# Altium schematic sheet Transistor Circuit.SchDoc
size A; DrawnBy: Jonathan Reese; Engineer: Jonathan Reese; Organization: URC; DocumentNumber: 2; Revision: 1; SheetNumber: 2; SheetTotal: 2; DocumentName: Pnuematics Transistor Circuit; ProjectName: Pnuematics Board
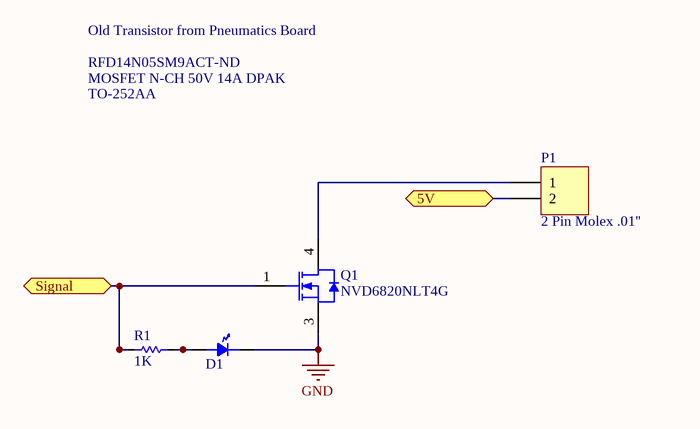
[diagram p0: Transistor Circuit.SchDoc]

## Parts
D1  LED  [LED0805]  (value not drawn)
P1  2 Pin Molex .01''  [HDR1X2]
Q1  NVD6820NLT4G  [ONSC-DPAK-3-369C-01_V]
R1  value 1K  [R0805]  (hidden comment: Resistor)

## Ports
5V, Signal

## Nets
GND: D1.1 Q1.3(S)
5V: P1.2 ; port 5V
Signal: Q1.1(G) R1.1 ; port Signal
NetD1_2: D1.2 R1.2
NetP1_1: P1.1 Q1.4(D)

## Notes on the sheet
- RFD14N05SM9ACT-ND
- MOSFET N-CH 50V 14A DPAK
- TO-252AA
- Old Transistor from Pneumatics Board
- Title
- Size:
- Date:
- A
- Number:
- Time:
- Revision:
- Sheet
- of
- File:

## Library data of the parts
P1 = Header 2: Header, 2-Pin; LatestRevisionDate: 17-Jul-2002; LatestRevisionNote: Re-released for DXP Platform.; Publisher: Altium Limited
Q1 = NVD6820NLT4G: Power MOSFET, 90 V, 50 A, 17 mOhm, Single N-Channel, 3-Pin DPAK, Pb-Free, Tape and Reel; Manufacturer: On Semiconductor; Channel Polarity: N Channel; Ciss Typ (pF): 4209; Coss Typ (pF): 253; Crss Typ (pF): 187; ID Max (A): 50; Qrr Typ (nC): 55; V(BR)DSS Min (V): 90; VGS Max (V): 20; VGS(th) Max (V): 2.5; DatasheetVersion: Rev. 1; PackageVersion: Rev. E, 02/2014; PackageReference: DPAK-3-369C-01; PackageDescription: 3-Pin Flange Mount, Body 6.54 x 6.095 mm, Pitch 2.29 mm; Supplier 1: Newark; Supplier Part Number 1: 60W1843; Supplier 2: Mouser; Supplier Part Number 2: 863-NVD6820NLT4G; Configuration: Single; Package Type: DPAK-3; Packing: Tape and Reel; RoHS: Pb-Free; Mounting Technology: Surface Mount; PartNumber: NVD6820NLT4G; ComponentLink1Description: Manufacturer URL; ComponentLink1URL: http://www.onsemi.com/; ComponentLink2Description: Datasheet; ComponentLink2URL: http://www.onsemi.cn/pub_link/Collateral/NVD6820NL-D.PDF; ComponentLink3Description: Package Specification; ComponentLink3URL: http://www.onsemi.cn/pub_link/Collateral/369C.PDF
R1 = Res: Tolerance: 5%